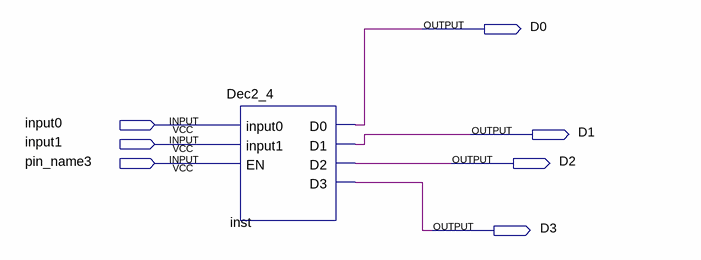
[diagram p0: schematic sheet]
// Quartus schematic DecoderDemo.bdf as structural Verilog: 1 symbols, 7 pins
module DecoderDemo (
  input  input0,
  input  input1,
  input  pin_name3,
  output D0,
  output D1,
  output D2,
  output D3
);

  Dec2_4 inst (.input0(input0), .input1(input1), .EN(pin_name3), .D0(D0), .D1(D1), .D2(D2), .D3(D3));
endmodule
